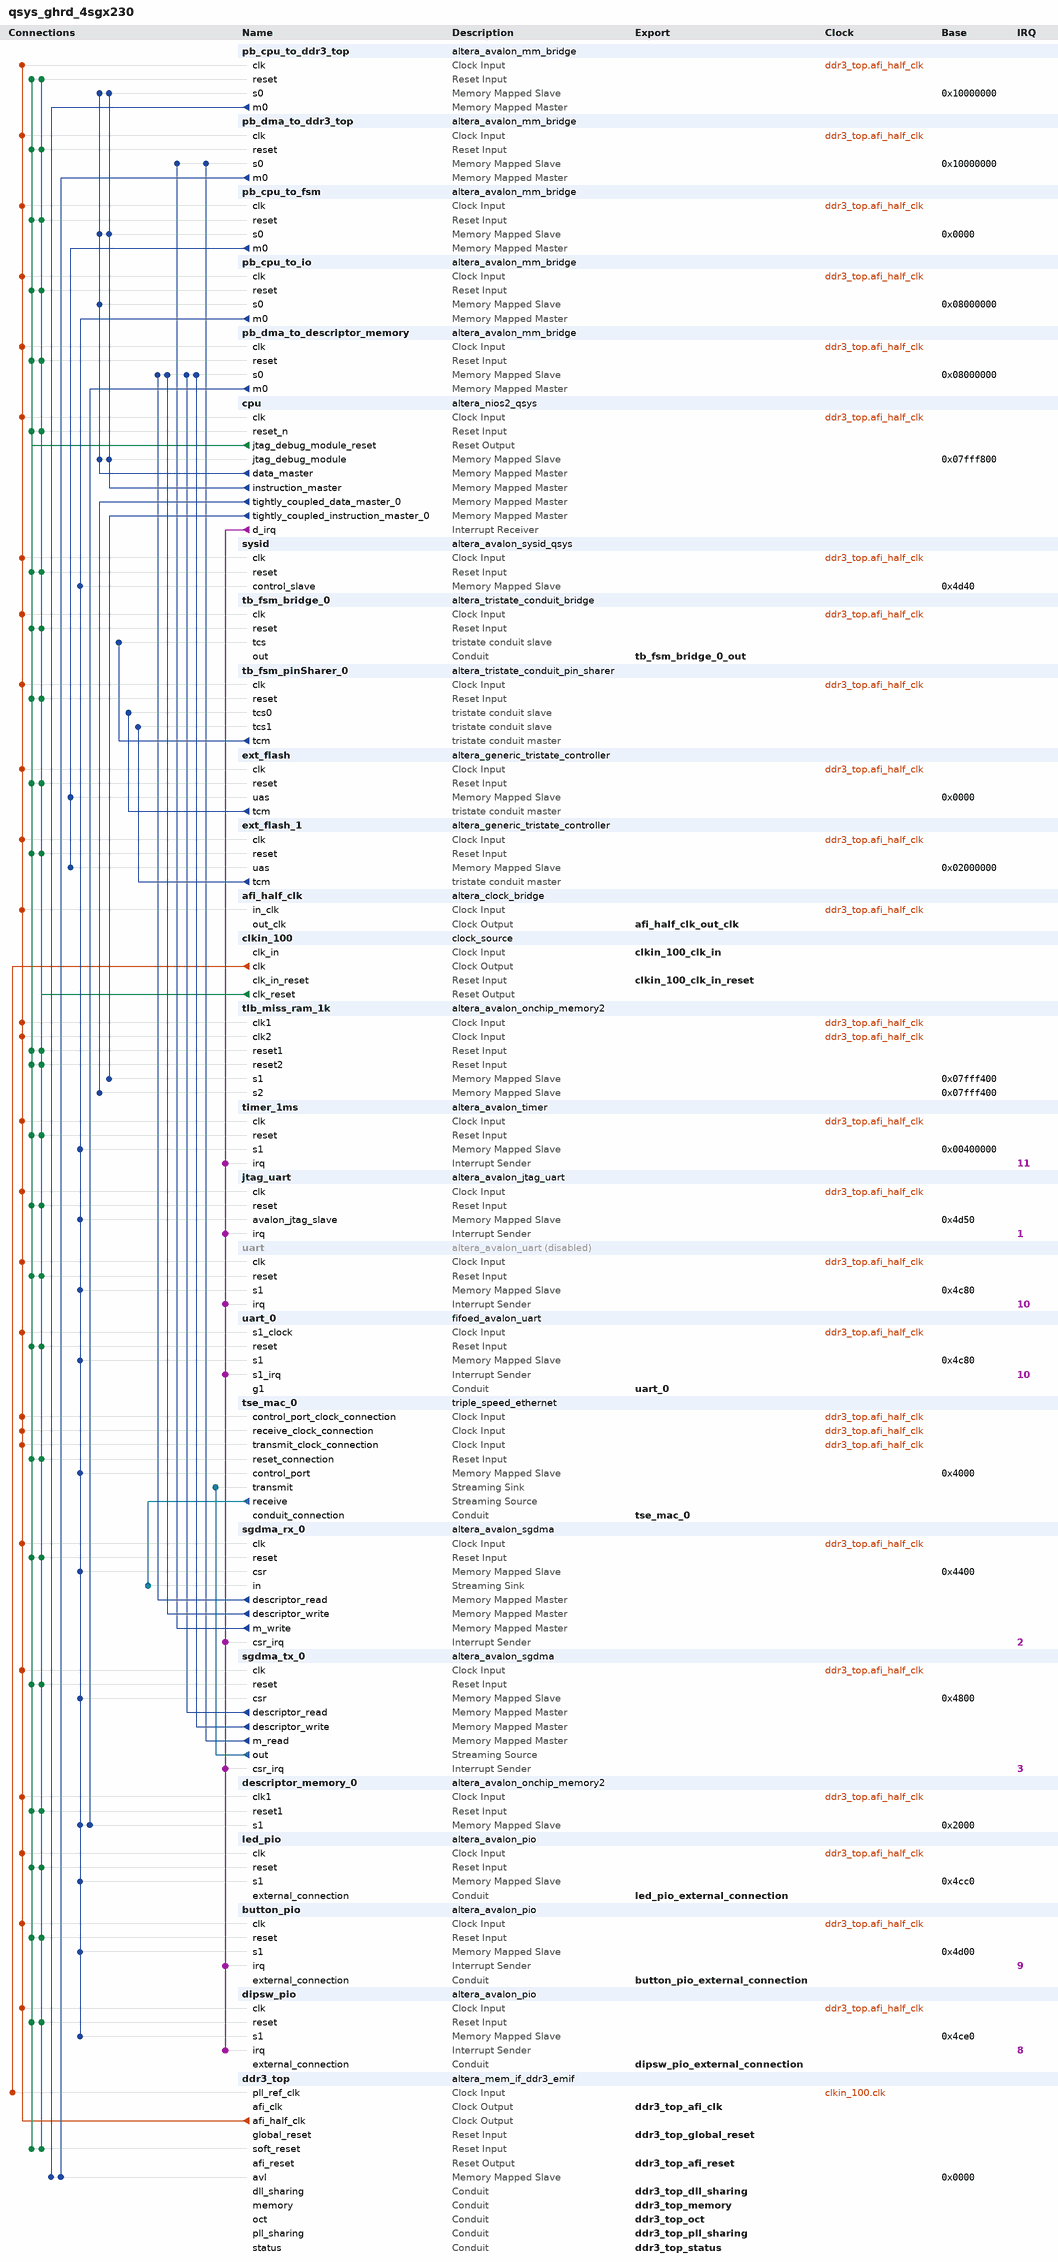
[diagram p0: system contents]
# Platform Designer (Qsys) system qsys_ghrd_4sgx230
# Parameters at their usual value, and those the tool derives, are not listed.
package require -exact qsys 11.1
create_system qsys_ghrd_4sgx230
set_project_property DEVICE_FAMILY STRATIXIV

add_instance pb_cpu_to_ddr3_top altera_avalon_mm_bridge 11.1
set_instance_parameter_value pb_cpu_to_ddr3_top DATA_WIDTH 32
set_instance_parameter_value pb_cpu_to_ddr3_top ADDRESS_WIDTH 27
set_instance_parameter_value pb_cpu_to_ddr3_top ADDRESS_UNITS SYMBOLS
set_instance_parameter_value pb_cpu_to_ddr3_top MAX_PENDING_RESPONSES 34

add_instance pb_dma_to_ddr3_top altera_avalon_mm_bridge 11.1
set_instance_parameter_value pb_dma_to_ddr3_top DATA_WIDTH 32
set_instance_parameter_value pb_dma_to_ddr3_top ADDRESS_WIDTH 27
set_instance_parameter_value pb_dma_to_ddr3_top ADDRESS_UNITS SYMBOLS
set_instance_parameter_value pb_dma_to_ddr3_top MAX_PENDING_RESPONSES 34

add_instance pb_cpu_to_fsm altera_avalon_mm_bridge 11.1
set_instance_parameter_value pb_cpu_to_fsm DATA_WIDTH 32
set_instance_parameter_value pb_cpu_to_fsm ADDRESS_WIDTH 26
set_instance_parameter_value pb_cpu_to_fsm ADDRESS_UNITS SYMBOLS
set_instance_parameter_value pb_cpu_to_fsm MAX_PENDING_RESPONSES 4

add_instance pb_cpu_to_io altera_avalon_mm_bridge 11.1
set_instance_parameter_value pb_cpu_to_io DATA_WIDTH 32
set_instance_parameter_value pb_cpu_to_io ADDRESS_WIDTH 23
set_instance_parameter_value pb_cpu_to_io ADDRESS_UNITS SYMBOLS
set_instance_parameter_value pb_cpu_to_io MAX_PENDING_RESPONSES 3

add_instance pb_dma_to_descriptor_memory altera_avalon_mm_bridge 11.1
set_instance_parameter_value pb_dma_to_descriptor_memory DATA_WIDTH 32
set_instance_parameter_value pb_dma_to_descriptor_memory ADDRESS_WIDTH 14
set_instance_parameter_value pb_dma_to_descriptor_memory ADDRESS_UNITS SYMBOLS
set_instance_parameter_value pb_dma_to_descriptor_memory MAX_PENDING_RESPONSES 2
set_instance_parameter_value pb_dma_to_descriptor_memory PIPELINE_RESPONSE 0

add_instance cpu altera_nios2_qsys 11.1
set_instance_parameter_value cpu muldiv_divider true
set_instance_parameter_value cpu mmu_enabled true
set_instance_parameter_value cpu manuallyAssignCpuID false
set_instance_parameter_value cpu resetOffset 8388608
set_instance_parameter_value cpu resetSlave ext_flash_1.uas
set_instance_parameter_value cpu mmu_TLBMissExcSlave tlb_miss_ram_1k.s1
set_instance_parameter_value cpu exceptionSlave ddr3_top.avl
set_instance_parameter_value cpu breakSlave cpu.jtag_debug_module
set_instance_parameter_value cpu muldiv_multiplierType DSPBlock
set_instance_parameter_value cpu impl Fast
set_instance_parameter_value cpu icache_size 32768
set_instance_parameter_value cpu icache_numTCIM 1
set_instance_parameter_value cpu dcache_size 32768
set_instance_parameter_value cpu dcache_numTCDM 1

add_instance sysid altera_avalon_sysid_qsys 11.1
set_instance_parameter_value sysid id 0

add_instance tb_fsm_bridge_0 altera_tristate_conduit_bridge 11.1

add_instance tb_fsm_pinSharer_0 altera_tristate_conduit_pin_sharer 11.1
set_instance_parameter_value tb_fsm_pinSharer_0 NUM_INTERFACES 2
set_instance_parameter_value tb_fsm_pinSharer_0 MODULE_ORIGIN_LIST ext_flash_1.tcm,ext_flash_1.tcm,ext_flash_1.tcm,ext_flash_1.tcm,ext_flash_1.tcm,ext_flash.tcm,ext_flash.tcm,ext_flash.tcm,ext_flash.tcm,ext_flash.tcm
set_instance_parameter_value tb_fsm_pinSharer_0 SIGNAL_ORIGIN_LIST address,read_n,write_n,data,chipselect_n,address,read_n,write_n,data,chipselect_n
set_instance_parameter_value tb_fsm_pinSharer_0 SHARED_SIGNAL_LIST tb_fsm_address,tb_fsm_readn,tb_fsm_writen,tb_fsm_data,select_n_to_the_ext_flash_1,tb_fsm_address,tb_fsm_readn,tb_fsm_writen,tb_fsm_data,select_n_to_the_ext_flash

add_instance ext_flash altera_generic_tristate_controller 11.1
set_instance_parameter_value ext_flash TCM_ADDRESS_W 25
set_instance_parameter_value ext_flash TCM_DATA_W 16
set_instance_parameter_value ext_flash TCM_BYTEENABLE_W 2
set_instance_parameter_value ext_flash TCM_READ_WAIT 100
set_instance_parameter_value ext_flash TCM_WRITE_WAIT 100
set_instance_parameter_value ext_flash TCM_SETUP_WAIT 25
set_instance_parameter_value ext_flash TCM_DATA_HOLD 20
set_instance_parameter_value ext_flash TCM_MAX_PENDING_READ_TRANSACTIONS 3
set_instance_parameter_value ext_flash TCM_TURNAROUND_TIME 2
set_instance_parameter_value ext_flash TCM_TIMING_UNITS 0
set_instance_parameter_value ext_flash TCM_READLATENCY 2
set_instance_parameter_value ext_flash TCM_SYMBOLS_PER_WORD 2
set_instance_parameter_value ext_flash USE_READ 1
set_instance_parameter_value ext_flash USE_BEGINTRANSFER 0
set_instance_parameter_value ext_flash USE_BYTEENABLE 0
set_instance_parameter_value ext_flash USE_OUTPUTENABLE 0
set_instance_parameter_value ext_flash ACTIVE_LOW_READ 1
set_instance_parameter_value ext_flash ACTIVE_LOW_BYTEENABLE 0
set_instance_parameter_value ext_flash ACTIVE_LOW_OUTPUTENABLE 0
set_instance_parameter_value ext_flash ACTIVE_LOW_BEGINTRANSFER 0
set_instance_parameter_value ext_flash CHIPSELECT_THROUGH_READLATENCY 0
set_instance_parameter_value ext_flash MODULE_ASSIGNMENT_KEYS embeddedsw.configuration.hwClassnameDriverSupportList,embeddedsw.configuration.hwClassnameDriverSupportDefault,embeddedsw.CMacro.SETUP_VALUE,embeddedsw.CMacro.WAIT_VALUE,embeddedsw.CMacro.HOLD_VALUE,embeddedsw.CMacro.TIMING_UNITS,embeddedsw.CMacro.SIZE,embeddedsw.memoryInfo.MEM_INIT_DATA_WIDTH,embeddedsw.memoryInfo.HAS_BYTE_LANE,embeddedsw.memoryInfo.IS_FLASH,embeddedsw.memoryInfo.GENERATE_DAT_SYM,embeddedsw.memoryInfo.GENERATE_FLASH,embeddedsw.memoryInfo.DAT_SYM_INSTALL_DIR,embeddedsw.memoryInfo.FLASH_INSTALL_DIR
set_instance_parameter_value ext_flash MODULE_ASSIGNMENT_VALUES {altera_avalon_lan91c111:altera_avalon_cfi_flash,altera_avalon_cfi_flash,25,100,20,"ns",33554432u,16,1,1,1,1,SIM_DIR,APP_DIR}
set_instance_parameter_value ext_flash INTERFACE_ASSIGNMENT_KEYS embeddedsw.configuration.isFlash,embeddedsw.configuration.isMemoryDevice,embeddedsw.configuration.isNonVolatileStorage
set_instance_parameter_value ext_flash INTERFACE_ASSIGNMENT_VALUES 1,1,1

add_instance ext_flash_1 altera_generic_tristate_controller 11.1
set_instance_parameter_value ext_flash_1 TCM_ADDRESS_W 25
set_instance_parameter_value ext_flash_1 TCM_DATA_W 16
set_instance_parameter_value ext_flash_1 TCM_BYTEENABLE_W 2
set_instance_parameter_value ext_flash_1 TCM_READ_WAIT 100
set_instance_parameter_value ext_flash_1 TCM_WRITE_WAIT 100
set_instance_parameter_value ext_flash_1 TCM_SETUP_WAIT 25
set_instance_parameter_value ext_flash_1 TCM_DATA_HOLD 20
set_instance_parameter_value ext_flash_1 TCM_MAX_PENDING_READ_TRANSACTIONS 3
set_instance_parameter_value ext_flash_1 TCM_TURNAROUND_TIME 2
set_instance_parameter_value ext_flash_1 TCM_TIMING_UNITS 0
set_instance_parameter_value ext_flash_1 TCM_READLATENCY 2
set_instance_parameter_value ext_flash_1 TCM_SYMBOLS_PER_WORD 2
set_instance_parameter_value ext_flash_1 USE_READ 1
set_instance_parameter_value ext_flash_1 USE_BEGINTRANSFER 0
set_instance_parameter_value ext_flash_1 USE_BYTEENABLE 0
set_instance_parameter_value ext_flash_1 USE_OUTPUTENABLE 0
set_instance_parameter_value ext_flash_1 ACTIVE_LOW_READ 1
set_instance_parameter_value ext_flash_1 ACTIVE_LOW_BYTEENABLE 0
set_instance_parameter_value ext_flash_1 ACTIVE_LOW_OUTPUTENABLE 0
set_instance_parameter_value ext_flash_1 ACTIVE_LOW_BEGINTRANSFER 0
set_instance_parameter_value ext_flash_1 CHIPSELECT_THROUGH_READLATENCY 0
set_instance_parameter_value ext_flash_1 MODULE_ASSIGNMENT_KEYS embeddedsw.configuration.hwClassnameDriverSupportList,embeddedsw.configuration.hwClassnameDriverSupportDefault,embeddedsw.CMacro.SETUP_VALUE,embeddedsw.CMacro.WAIT_VALUE,embeddedsw.CMacro.HOLD_VALUE,embeddedsw.CMacro.TIMING_UNITS,embeddedsw.CMacro.SIZE,embeddedsw.memoryInfo.MEM_INIT_DATA_WIDTH,embeddedsw.memoryInfo.HAS_BYTE_LANE,embeddedsw.memoryInfo.IS_FLASH,embeddedsw.memoryInfo.GENERATE_DAT_SYM,embeddedsw.memoryInfo.GENERATE_FLASH,embeddedsw.memoryInfo.DAT_SYM_INSTALL_DIR,embeddedsw.memoryInfo.FLASH_INSTALL_DIR
set_instance_parameter_value ext_flash_1 MODULE_ASSIGNMENT_VALUES {altera_avalon_lan91c111:altera_avalon_cfi_flash,altera_avalon_cfi_flash,25,100,20,"ns",33554432u,16,1,1,1,1,SIM_DIR,APP_DIR}
set_instance_parameter_value ext_flash_1 INTERFACE_ASSIGNMENT_KEYS embeddedsw.configuration.isFlash,embeddedsw.configuration.isMemoryDevice,embeddedsw.configuration.isNonVolatileStorage
set_instance_parameter_value ext_flash_1 INTERFACE_ASSIGNMENT_VALUES 1,1,1

add_instance afi_half_clk altera_clock_bridge 11.1
set_instance_parameter_value afi_half_clk DERIVED_CLOCK_RATE 75000000
set_instance_parameter_value afi_half_clk EXPLICIT_CLOCK_RATE 0

add_instance clkin_100 clock_source 11.1
set_instance_parameter_value clkin_100 clockFrequency 100000000

add_instance tlb_miss_ram_1k altera_avalon_onchip_memory2 11.1
set_instance_parameter_value tlb_miss_ram_1k dataWidth 32
set_instance_parameter_value tlb_miss_ram_1k dualPort true
set_instance_parameter_value tlb_miss_ram_1k initMemContent true
set_instance_parameter_value tlb_miss_ram_1k initializationFileName tlb_miss_ram_1k
set_instance_parameter_value tlb_miss_ram_1k memorySize 1024

add_instance timer_1ms altera_avalon_timer 11.1
set_instance_parameter_value timer_1ms period 1
set_instance_parameter_value timer_1ms periodUnits MSEC
set_instance_parameter_value timer_1ms timerPreset FULL_FEATURED

add_instance jtag_uart altera_avalon_jtag_uart 11.1
set_instance_parameter_value jtag_uart simInteractiveOptions INTERACTIVE_ASCII_OUTPUT

add_instance uart altera_avalon_uart 11.1
set_instance_property uart ENABLED false
set_instance_parameter_value uart baud 115200
set_instance_parameter_value uart dataBits 8
set_instance_parameter_value uart fixedBaud false
set_instance_parameter_value uart parity NONE
set_instance_parameter_value uart stopBits 1

add_instance uart_0 fifoed_avalon_uart 11.1
set_instance_parameter_value uart_0 clock_freq 75000000
set_instance_parameter_value uart_0 baud 115200
set_instance_parameter_value uart_0 data_bits 8
set_instance_parameter_value uart_0 fixed_baud true
set_instance_parameter_value uart_0 parity N
set_instance_parameter_value uart_0 stop_bits 1
set_instance_parameter_value uart_0 use_cts_rts false
set_instance_parameter_value uart_0 use_eop_register false
set_instance_parameter_value uart_0 sim_true_baud 0
set_instance_parameter_value uart_0 sim_char_stream DEADBEEF
set_instance_parameter_value uart_0 use_tx_fifo true
set_instance_parameter_value uart_0 fifo_size_tx 128
set_instance_parameter_value uart_0 tx_fifo_LE false
set_instance_parameter_value uart_0 tx_IRQ_Threshold 1
set_instance_parameter_value uart_0 use_rx_fifo true
set_instance_parameter_value uart_0 fifo_size_rx 128
set_instance_parameter_value uart_0 rx_fifo_LE false
set_instance_parameter_value uart_0 rx_IRQ_Threshold 1
set_instance_parameter_value uart_0 fifo_export_used false
set_instance_parameter_value uart_0 Has_IRQ true
set_instance_parameter_value uart_0 hw_cts false
set_instance_parameter_value uart_0 trans_pin false
set_instance_parameter_value uart_0 console_port true
set_instance_parameter_value uart_0 use_timout false
set_instance_parameter_value uart_0 timeout_value 4
set_instance_parameter_value uart_0 use_gap_detection false
set_instance_parameter_value uart_0 gap_value 4
set_instance_parameter_value uart_0 use_timestamp false
set_instance_parameter_value uart_0 use_ext_timestamp false
set_instance_parameter_value uart_0 timestamp_width 8
set_instance_parameter_value uart_0 add_error_bits false
set_instance_parameter_value uart_0 driver_pass_error_bits false

add_instance tse_mac_0 triple_speed_ethernet 11.1
set_instance_parameter_value tse_mac_0 atlanticSinkClockRate 0
set_instance_parameter_value tse_mac_0 atlanticSinkClockSource unassigned
set_instance_parameter_value tse_mac_0 atlanticSourceClockRate 0
set_instance_parameter_value tse_mac_0 atlanticSourceClockSource unassigned
set_instance_parameter_value tse_mac_0 avalonSlaveClockRate 0
set_instance_parameter_value tse_mac_0 avalonSlaveClockSource unassigned
set_instance_parameter_value tse_mac_0 avalonStNeighbours {unassigned=unassigned}
set_instance_parameter_value tse_mac_0 channel_count 1
set_instance_parameter_value tse_mac_0 core_variation MAC_PCS
set_instance_parameter_value tse_mac_0 core_version 2817
set_instance_parameter_value tse_mac_0 crc32check16bit 0
set_instance_parameter_value tse_mac_0 crc32dwidth 8
set_instance_parameter_value tse_mac_0 crc32gendelay 6
set_instance_parameter_value tse_mac_0 crc32s1l2_extern false
set_instance_parameter_value tse_mac_0 cust_version 0
set_instance_parameter_value tse_mac_0 dataBitsPerSymbol 8
set_instance_parameter_value tse_mac_0 dev_version 2817
set_instance_parameter_value tse_mac_0 eg_addr 11
set_instance_parameter_value tse_mac_0 ena_hash false
set_instance_parameter_value tse_mac_0 enable_alt_reconfig false
set_instance_parameter_value tse_mac_0 enable_clk_sharing false
set_instance_parameter_value tse_mac_0 enable_ena 32
set_instance_parameter_value tse_mac_0 enable_fifoless false
set_instance_parameter_value tse_mac_0 enable_gmii_loopback false
set_instance_parameter_value tse_mac_0 enable_hd_logic false
set_instance_parameter_value tse_mac_0 enable_mac_flow_ctrl false
set_instance_parameter_value tse_mac_0 enable_mac_txaddr_set true
set_instance_parameter_value tse_mac_0 enable_mac_vlan false
set_instance_parameter_value tse_mac_0 enable_maclite false
set_instance_parameter_value tse_mac_0 enable_magic_detect true
set_instance_parameter_value tse_mac_0 enable_multi_channel false
set_instance_parameter_value tse_mac_0 enable_pkt_class true
set_instance_parameter_value tse_mac_0 enable_pma false
set_instance_parameter_value tse_mac_0 enable_reg_sharing false
set_instance_parameter_value tse_mac_0 enable_sgmii true
set_instance_parameter_value tse_mac_0 enable_shift16 true
set_instance_parameter_value tse_mac_0 enable_sup_addr false
set_instance_parameter_value tse_mac_0 enable_use_internal_fifo true
set_instance_parameter_value tse_mac_0 export_calblkclk false
set_instance_parameter_value tse_mac_0 export_pwrdn false
set_instance_parameter_value tse_mac_0 ext_stat_cnt_ena false
set_instance_parameter_value tse_mac_0 gigeAdvanceMode true
set_instance_parameter_value tse_mac_0 ifGMII MII_GMII
set_instance_parameter_value tse_mac_0 ifPCSuseEmbeddedSerdes true
set_instance_parameter_value tse_mac_0 ing_addr 11
set_instance_parameter_value tse_mac_0 insert_ta true
set_instance_parameter_value tse_mac_0 maclite_gige false
set_instance_parameter_value tse_mac_0 max_channels 1
set_instance_parameter_value tse_mac_0 mdio_clk_div 40
set_instance_parameter_value tse_mac_0 phy_identifier 0
set_instance_parameter_value tse_mac_0 ramType AUTO
set_instance_parameter_value tse_mac_0 reset_level 1
set_instance_parameter_value tse_mac_0 starting_channel_number 0
set_instance_parameter_value tse_mac_0 stat_cnt_ena true
set_instance_parameter_value tse_mac_0 timingAdapterName timingAdapter
set_instance_parameter_value tse_mac_0 toolContext SOPC_BUILDER
set_instance_parameter_value tse_mac_0 transceiver_type LVDS_IO
set_instance_parameter_value tse_mac_0 uiHostClockFrequency 0
set_instance_parameter_value tse_mac_0 uiMDIOFreq {0.0 MHz}
set_instance_parameter_value tse_mac_0 useLvds true
set_instance_parameter_value tse_mac_0 useMAC true
set_instance_parameter_value tse_mac_0 useMDIO true
set_instance_parameter_value tse_mac_0 usePCS true
set_instance_parameter_value tse_mac_0 use_sync_reset true

add_instance sgdma_rx_0 altera_avalon_sgdma 11.1
set_instance_parameter_value sgdma_rx_0 enableBurstTransfers false
set_instance_parameter_value sgdma_rx_0 enableUnalignedTransfers true
set_instance_parameter_value sgdma_rx_0 readBlockDataWidth 32
set_instance_parameter_value sgdma_rx_0 sinkErrorWidth 6
set_instance_parameter_value sgdma_rx_0 sourceErrorWidth 0
set_instance_parameter_value sgdma_rx_0 transferMode STREAM_TO_MEMORY
set_instance_parameter_value sgdma_rx_0 writeBurstcountWidth 4

add_instance sgdma_tx_0 altera_avalon_sgdma 11.1
set_instance_parameter_value sgdma_tx_0 enableBurstTransfers false
set_instance_parameter_value sgdma_tx_0 enableUnalignedTransfers true
set_instance_parameter_value sgdma_tx_0 readBlockDataWidth 32
set_instance_parameter_value sgdma_tx_0 sinkErrorWidth 0
set_instance_parameter_value sgdma_tx_0 sourceErrorWidth 1
set_instance_parameter_value sgdma_tx_0 transferMode MEMORY_TO_STREAM
set_instance_parameter_value sgdma_tx_0 writeBurstcountWidth 4

add_instance descriptor_memory_0 altera_avalon_onchip_memory2 11.1
set_instance_parameter_value descriptor_memory_0 dataWidth 32
set_instance_parameter_value descriptor_memory_0 dualPort false
set_instance_parameter_value descriptor_memory_0 initMemContent true
set_instance_parameter_value descriptor_memory_0 initializationFileName descriptor_memory_0
set_instance_parameter_value descriptor_memory_0 memorySize 8192

add_instance led_pio altera_avalon_pio 11.1
set_instance_parameter_value led_pio direction Output
set_instance_parameter_value led_pio width 16

add_instance button_pio altera_avalon_pio 11.1
set_instance_parameter_value button_pio captureEdge true
set_instance_parameter_value button_pio direction Input
set_instance_parameter_value button_pio edgeType ANY
set_instance_parameter_value button_pio generateIRQ true
set_instance_parameter_value button_pio irqType EDGE
set_instance_parameter_value button_pio simDoTestBenchWiring true
set_instance_parameter_value button_pio simDrivenValue 7
set_instance_parameter_value button_pio width 3

add_instance dipsw_pio altera_avalon_pio 11.1
set_instance_parameter_value dipsw_pio bitClearingEdgeCapReg true
set_instance_parameter_value dipsw_pio captureEdge true
set_instance_parameter_value dipsw_pio direction Input
set_instance_parameter_value dipsw_pio edgeType ANY
set_instance_parameter_value dipsw_pio generateIRQ true
set_instance_parameter_value dipsw_pio irqType EDGE
set_instance_parameter_value dipsw_pio simDoTestBenchWiring true
set_instance_parameter_value dipsw_pio width 8

add_instance ddr3_top altera_mem_if_ddr3_emif 11.1
set_instance_parameter_value ddr3_top MEM_VENDOR Micron
set_instance_parameter_value ddr3_top MEM_FORMAT DISCRETE
set_instance_parameter_value ddr3_top MEM_CLK_FREQ_MAX 666.667
set_instance_parameter_value ddr3_top MEM_ROW_ADDR_WIDTH 13
set_instance_parameter_value ddr3_top MEM_COL_ADDR_WIDTH 10
set_instance_parameter_value ddr3_top MEM_DQ_WIDTH 16
set_instance_parameter_value ddr3_top MEM_BANKADDR_WIDTH 3
set_instance_parameter_value ddr3_top MEM_RTT_NOM RZQ/4
set_instance_parameter_value ddr3_top MEM_WTCL 6
set_instance_parameter_value ddr3_top MEM_TCL 8
set_instance_parameter_value ddr3_top TIMING_TIS 190
set_instance_parameter_value ddr3_top TIMING_TIH 140
set_instance_parameter_value ddr3_top TIMING_TDS 30
set_instance_parameter_value ddr3_top TIMING_TDH 65
set_instance_parameter_value ddr3_top TIMING_TDQSQ 125
set_instance_parameter_value ddr3_top TIMING_TDQSCK 255
set_instance_parameter_value ddr3_top TIMING_TDQSS 0.25
set_instance_parameter_value ddr3_top TIMING_TQSH 0.4
set_instance_parameter_value ddr3_top TIMING_TDSH 0.2
set_instance_parameter_value ddr3_top TIMING_TDSS 0.2
set_instance_parameter_value ddr3_top MEM_TRAS_NS 36.0
set_instance_parameter_value ddr3_top MEM_TRCD_NS 13.5
set_instance_parameter_value ddr3_top MEM_TRP_NS 13.5
set_instance_parameter_value ddr3_top MEM_TRFC_NS 110.0
set_instance_parameter_value ddr3_top MEM_TWTR 4
set_instance_parameter_value ddr3_top MEM_TFAW_NS 30.0
set_instance_parameter_value ddr3_top MEM_TRRD_NS 6.0
set_instance_parameter_value ddr3_top MEM_TRTP_NS 7.5
set_instance_parameter_value ddr3_top POWER_OF_TWO_BUS true
set_instance_parameter_value ddr3_top AVL_MAX_SIZE 16
set_instance_parameter_value ddr3_top CFG_REORDER_DATA false
set_instance_parameter_value ddr3_top PRIORITY_PORT 0,0,0,0,0,0
set_instance_parameter_value ddr3_top CPORT_TYPE_PORT Bidirectional,Bidirectional,Bidirectional,Bidirectional,Bidirectional,Bidirectional
set_instance_parameter_value ddr3_top REF_CLK_FREQ 100.0
set_instance_parameter_value ddr3_top HHP_REMAP_ADDR true
set_instance_parameter_value ddr3_top USE_SEQUENCER_APB_BRIDGE false
set_instance_parameter_value ddr3_top DEFAULT_FAST_SIM_MODEL true
set_instance_parameter_value ddr3_top PLL_SHARING_MODE Master
set_instance_parameter_value ddr3_top DLL_SHARING_MODE Master
set_instance_parameter_value ddr3_top PLL_LOCATION Top_Bottom
set_instance_parameter_value ddr3_top CALIBRATION_MODE Full
set_instance_parameter_value ddr3_top USER_DEBUG_LEVEL 1
set_instance_parameter_value ddr3_top TIMING_BOARD_DERATE_METHOD SLEW_RATE
set_instance_parameter_value ddr3_top TIMING_BOARD_MAX_CK_DELAY 0.6
set_instance_parameter_value ddr3_top TIMING_BOARD_MAX_DQS_DELAY 0.6
set_instance_parameter_value ddr3_top TIMING_BOARD_SKEW_CKDQS_DIMM_MIN -0.079
set_instance_parameter_value ddr3_top TIMING_BOARD_SKEW_CKDQS_DIMM_MAX -0.021
set_instance_parameter_value ddr3_top TIMING_BOARD_SKEW_WITHIN_DQS 0.017
set_instance_parameter_value ddr3_top TIMING_BOARD_SKEW_BETWEEN_DQS 0.058
set_instance_parameter_value ddr3_top TIMING_BOARD_DQ_TO_DQS_SKEW -0.0090
set_instance_parameter_value ddr3_top TIMING_BOARD_AC_SKEW 0.084
set_instance_parameter_value ddr3_top TIMING_BOARD_AC_TO_CK_SKEW -0.025
set_instance_parameter_value ddr3_top RATE Half
set_instance_parameter_value ddr3_top MEM_CLK_FREQ 300.0
set_instance_parameter_value ddr3_top DQS_TRK_ENABLED false
set_instance_parameter_value ddr3_top SPEED_GRADE 2
set_instance_parameter_value ddr3_top HARD_EMIF false
set_instance_parameter_value ddr3_top ENABLE_ABS_RAM_MEM_INIT true

# connections
add_connection clkin_100.clk ddr3_top.pll_ref_clk clock
add_connection ddr3_top.afi_half_clk afi_half_clk.in_clk clock
add_connection ddr3_top.afi_half_clk button_pio.clk clock
add_connection ddr3_top.afi_half_clk cpu.clk clock
add_connection ddr3_top.afi_half_clk descriptor_memory_0.clk1 clock
add_connection ddr3_top.afi_half_clk dipsw_pio.clk clock
add_connection ddr3_top.afi_half_clk ext_flash.clk clock
add_connection ddr3_top.afi_half_clk ext_flash_1.clk clock
add_connection ddr3_top.afi_half_clk jtag_uart.clk clock
add_connection ddr3_top.afi_half_clk led_pio.clk clock
add_connection ddr3_top.afi_half_clk pb_cpu_to_ddr3_top.clk clock
add_connection ddr3_top.afi_half_clk pb_cpu_to_fsm.clk clock
add_connection ddr3_top.afi_half_clk pb_cpu_to_io.clk clock
add_connection ddr3_top.afi_half_clk pb_dma_to_ddr3_top.clk clock
add_connection ddr3_top.afi_half_clk pb_dma_to_descriptor_memory.clk clock
add_connection ddr3_top.afi_half_clk sgdma_rx_0.clk clock
add_connection ddr3_top.afi_half_clk sgdma_tx_0.clk clock
add_connection ddr3_top.afi_half_clk sysid.clk clock
add_connection ddr3_top.afi_half_clk tb_fsm_bridge_0.clk clock
add_connection ddr3_top.afi_half_clk tb_fsm_pinSharer_0.clk clock
add_connection ddr3_top.afi_half_clk timer_1ms.clk clock
add_connection ddr3_top.afi_half_clk tlb_miss_ram_1k.clk1 clock
add_connection ddr3_top.afi_half_clk tlb_miss_ram_1k.clk2 clock
add_connection ddr3_top.afi_half_clk tse_mac_0.control_port_clock_connection clock
add_connection ddr3_top.afi_half_clk tse_mac_0.receive_clock_connection clock
add_connection ddr3_top.afi_half_clk tse_mac_0.transmit_clock_connection clock
add_connection ddr3_top.afi_half_clk uart.clk clock
add_connection ddr3_top.afi_half_clk uart_0.s1_clock clock
add_connection clkin_100.clk_reset button_pio.reset reset
add_connection clkin_100.clk_reset cpu.reset_n reset
add_connection clkin_100.clk_reset ddr3_top.soft_reset reset
add_connection clkin_100.clk_reset descriptor_memory_0.reset1 reset
add_connection clkin_100.clk_reset dipsw_pio.reset reset
add_connection clkin_100.clk_reset ext_flash.reset reset
add_connection clkin_100.clk_reset ext_flash_1.reset reset
add_connection clkin_100.clk_reset jtag_uart.reset reset
add_connection clkin_100.clk_reset led_pio.reset reset
add_connection clkin_100.clk_reset pb_cpu_to_ddr3_top.reset reset
add_connection clkin_100.clk_reset pb_cpu_to_fsm.reset reset
add_connection clkin_100.clk_reset pb_cpu_to_io.reset reset
add_connection clkin_100.clk_reset pb_dma_to_ddr3_top.reset reset
add_connection clkin_100.clk_reset pb_dma_to_descriptor_memory.reset reset
add_connection clkin_100.clk_reset sgdma_rx_0.reset reset
add_connection clkin_100.clk_reset sgdma_tx_0.reset reset
add_connection clkin_100.clk_reset sysid.reset reset
add_connection clkin_100.clk_reset tb_fsm_bridge_0.reset reset
add_connection clkin_100.clk_reset tb_fsm_pinSharer_0.reset reset
add_connection clkin_100.clk_reset timer_1ms.reset reset
add_connection clkin_100.clk_reset tlb_miss_ram_1k.reset1 reset
add_connection clkin_100.clk_reset tlb_miss_ram_1k.reset2 reset
add_connection clkin_100.clk_reset tse_mac_0.reset_connection reset
add_connection clkin_100.clk_reset uart.reset reset
add_connection clkin_100.clk_reset uart_0.reset reset
add_connection cpu.jtag_debug_module_reset button_pio.reset reset
add_connection cpu.jtag_debug_module_reset cpu.reset_n reset
add_connection cpu.jtag_debug_module_reset ddr3_top.soft_reset reset
add_connection cpu.jtag_debug_module_reset descriptor_memory_0.reset1 reset
add_connection cpu.jtag_debug_module_reset dipsw_pio.reset reset
add_connection cpu.jtag_debug_module_reset ext_flash.reset reset
add_connection cpu.jtag_debug_module_reset ext_flash_1.reset reset
add_connection cpu.jtag_debug_module_reset jtag_uart.reset reset
add_connection cpu.jtag_debug_module_reset led_pio.reset reset
add_connection cpu.jtag_debug_module_reset pb_cpu_to_ddr3_top.reset reset
add_connection cpu.jtag_debug_module_reset pb_cpu_to_fsm.reset reset
add_connection cpu.jtag_debug_module_reset pb_cpu_to_io.reset reset
add_connection cpu.jtag_debug_module_reset pb_dma_to_ddr3_top.reset reset
add_connection cpu.jtag_debug_module_reset pb_dma_to_descriptor_memory.reset reset
add_connection cpu.jtag_debug_module_reset sgdma_rx_0.reset reset
add_connection cpu.jtag_debug_module_reset sgdma_tx_0.reset reset
add_connection cpu.jtag_debug_module_reset sysid.reset reset
add_connection cpu.jtag_debug_module_reset tb_fsm_bridge_0.reset reset
add_connection cpu.jtag_debug_module_reset tb_fsm_pinSharer_0.reset reset
add_connection cpu.jtag_debug_module_reset timer_1ms.reset reset
add_connection cpu.jtag_debug_module_reset tlb_miss_ram_1k.reset1 reset
add_connection cpu.jtag_debug_module_reset tlb_miss_ram_1k.reset2 reset
add_connection cpu.jtag_debug_module_reset tse_mac_0.reset_connection reset
add_connection cpu.jtag_debug_module_reset uart.reset reset
add_connection cpu.jtag_debug_module_reset uart_0.reset reset
add_connection cpu.data_master cpu.jtag_debug_module avalon
set_connection_parameter_value cpu.data_master/cpu.jtag_debug_module baseAddress 0x07fff800
add_connection cpu.data_master pb_cpu_to_ddr3_top.s0 avalon
set_connection_parameter_value cpu.data_master/pb_cpu_to_ddr3_top.s0 arbitrationPriority 8
set_connection_parameter_value cpu.data_master/pb_cpu_to_ddr3_top.s0 baseAddress 0x10000000
add_connection cpu.data_master pb_cpu_to_fsm.s0 avalon
set_connection_parameter_value cpu.data_master/pb_cpu_to_fsm.s0 arbitrationPriority 8
set_connection_parameter_value cpu.data_master/pb_cpu_to_fsm.s0 baseAddress 0x0000
add_connection cpu.data_master pb_cpu_to_io.s0 avalon
set_connection_parameter_value cpu.data_master/pb_cpu_to_io.s0 baseAddress 0x08000000
add_connection cpu.instruction_master cpu.jtag_debug_module avalon
set_connection_parameter_value cpu.instruction_master/cpu.jtag_debug_module baseAddress 0x07fff800
add_connection cpu.instruction_master pb_cpu_to_ddr3_top.s0 avalon
set_connection_parameter_value cpu.instruction_master/pb_cpu_to_ddr3_top.s0 arbitrationPriority 8
set_connection_parameter_value cpu.instruction_master/pb_cpu_to_ddr3_top.s0 baseAddress 0x10000000
add_connection cpu.instruction_master pb_cpu_to_fsm.s0 avalon
set_connection_parameter_value cpu.instruction_master/pb_cpu_to_fsm.s0 arbitrationPriority 8
set_connection_parameter_value cpu.instruction_master/pb_cpu_to_fsm.s0 baseAddress 0x0000
add_connection cpu.tightly_coupled_data_master_0 tlb_miss_ram_1k.s2 avalon
set_connection_parameter_value cpu.tightly_coupled_data_master_0/tlb_miss_ram_1k.s2 baseAddress 0x07fff400
add_connection cpu.tightly_coupled_instruction_master_0 tlb_miss_ram_1k.s1 avalon
set_connection_parameter_value cpu.tightly_coupled_instruction_master_0/tlb_miss_ram_1k.s1 baseAddress 0x07fff400
add_connection pb_cpu_to_ddr3_top.m0 ddr3_top.avl avalon
set_connection_parameter_value pb_cpu_to_ddr3_top.m0/ddr3_top.avl baseAddress 0x0000
add_connection pb_cpu_to_fsm.m0 ext_flash.uas avalon
set_connection_parameter_value pb_cpu_to_fsm.m0/ext_flash.uas baseAddress 0x0000
add_connection pb_cpu_to_fsm.m0 ext_flash_1.uas avalon
set_connection_parameter_value pb_cpu_to_fsm.m0/ext_flash_1.uas baseAddress 0x02000000
add_connection pb_cpu_to_io.m0 button_pio.s1 avalon
set_connection_parameter_value pb_cpu_to_io.m0/button_pio.s1 baseAddress 0x4d00
add_connection pb_cpu_to_io.m0 descriptor_memory_0.s1 avalon
set_connection_parameter_value pb_cpu_to_io.m0/descriptor_memory_0.s1 baseAddress 0x2000
add_connection pb_cpu_to_io.m0 dipsw_pio.s1 avalon
set_connection_parameter_value pb_cpu_to_io.m0/dipsw_pio.s1 baseAddress 0x4ce0
add_connection pb_cpu_to_io.m0 jtag_uart.avalon_jtag_slave avalon
set_connection_parameter_value pb_cpu_to_io.m0/jtag_uart.avalon_jtag_slave baseAddress 0x4d50
add_connection pb_cpu_to_io.m0 led_pio.s1 avalon
set_connection_parameter_value pb_cpu_to_io.m0/led_pio.s1 baseAddress 0x4cc0
add_connection pb_cpu_to_io.m0 sgdma_rx_0.csr avalon
set_connection_parameter_value pb_cpu_to_io.m0/sgdma_rx_0.csr baseAddress 0x4400
add_connection pb_cpu_to_io.m0 sgdma_tx_0.csr avalon
set_connection_parameter_value pb_cpu_to_io.m0/sgdma_tx_0.csr baseAddress 0x4800
add_connection pb_cpu_to_io.m0 sysid.control_slave avalon
set_connection_parameter_value pb_cpu_to_io.m0/sysid.control_slave baseAddress 0x4d40
add_connection pb_cpu_to_io.m0 timer_1ms.s1 avalon
set_connection_parameter_value pb_cpu_to_io.m0/timer_1ms.s1 baseAddress 0x00400000
add_connection pb_cpu_to_io.m0 tse_mac_0.control_port avalon
set_connection_parameter_value pb_cpu_to_io.m0/tse_mac_0.control_port baseAddress 0x4000
add_connection pb_cpu_to_io.m0 uart.s1 avalon
set_connection_parameter_value pb_cpu_to_io.m0/uart.s1 baseAddress 0x4c80
add_connection pb_cpu_to_io.m0 uart_0.s1 avalon
set_connection_parameter_value pb_cpu_to_io.m0/uart_0.s1 baseAddress 0x4c80
add_connection pb_dma_to_ddr3_top.m0 ddr3_top.avl avalon
set_connection_parameter_value pb_dma_to_ddr3_top.m0/ddr3_top.avl baseAddress 0x0000
add_connection pb_dma_to_descriptor_memory.m0 descriptor_memory_0.s1 avalon
set_connection_parameter_value pb_dma_to_descriptor_memory.m0/descriptor_memory_0.s1 arbitrationPriority 8
set_connection_parameter_value pb_dma_to_descriptor_memory.m0/descriptor_memory_0.s1 baseAddress 0x2000
add_connection sgdma_rx_0.descriptor_read pb_dma_to_descriptor_memory.s0 avalon
set_connection_parameter_value sgdma_rx_0.descriptor_read/pb_dma_to_descriptor_memory.s0 arbitrationPriority 8
set_connection_parameter_value sgdma_rx_0.descriptor_read/pb_dma_to_descriptor_memory.s0 baseAddress 0x08000000
add_connection sgdma_rx_0.descriptor_write pb_dma_to_descriptor_memory.s0 avalon
set_connection_parameter_value sgdma_rx_0.descriptor_write/pb_dma_to_descriptor_memory.s0 arbitrationPriority 8
set_connection_parameter_value sgdma_rx_0.descriptor_write/pb_dma_to_descriptor_memory.s0 baseAddress 0x08000000
add_connection sgdma_rx_0.m_write pb_dma_to_ddr3_top.s0 avalon
set_connection_parameter_value sgdma_rx_0.m_write/pb_dma_to_ddr3_top.s0 arbitrationPriority 8
set_connection_parameter_value sgdma_rx_0.m_write/pb_dma_to_ddr3_top.s0 baseAddress 0x10000000
add_connection sgdma_tx_0.descriptor_read pb_dma_to_descriptor_memory.s0 avalon
set_connection_parameter_value sgdma_tx_0.descriptor_read/pb_dma_to_descriptor_memory.s0 arbitrationPriority 8
set_connection_parameter_value sgdma_tx_0.descriptor_read/pb_dma_to_descriptor_memory.s0 baseAddress 0x08000000
add_connection sgdma_tx_0.descriptor_write pb_dma_to_descriptor_memory.s0 avalon
set_connection_parameter_value sgdma_tx_0.descriptor_write/pb_dma_to_descriptor_memory.s0 arbitrationPriority 8
set_connection_parameter_value sgdma_tx_0.descriptor_write/pb_dma_to_descriptor_memory.s0 baseAddress 0x08000000
add_connection sgdma_tx_0.m_read pb_dma_to_ddr3_top.s0 avalon
set_connection_parameter_value sgdma_tx_0.m_read/pb_dma_to_ddr3_top.s0 arbitrationPriority 8
set_connection_parameter_value sgdma_tx_0.m_read/pb_dma_to_ddr3_top.s0 baseAddress 0x10000000
add_connection sgdma_tx_0.out tse_mac_0.transmit avalon_streaming
add_connection tse_mac_0.receive sgdma_rx_0.in avalon_streaming
add_connection cpu.d_irq button_pio.irq interrupt
set_connection_parameter_value cpu.d_irq/button_pio.irq irqNumber 9
add_connection cpu.d_irq dipsw_pio.irq interrupt
set_connection_parameter_value cpu.d_irq/dipsw_pio.irq irqNumber 8
add_connection cpu.d_irq jtag_uart.irq interrupt
set_connection_parameter_value cpu.d_irq/jtag_uart.irq irqNumber 1
add_connection cpu.d_irq sgdma_rx_0.csr_irq interrupt
set_connection_parameter_value cpu.d_irq/sgdma_rx_0.csr_irq irqNumber 2
add_connection cpu.d_irq sgdma_tx_0.csr_irq interrupt
set_connection_parameter_value cpu.d_irq/sgdma_tx_0.csr_irq irqNumber 3
add_connection cpu.d_irq timer_1ms.irq interrupt
set_connection_parameter_value cpu.d_irq/timer_1ms.irq irqNumber 11
add_connection cpu.d_irq uart.irq interrupt
set_connection_parameter_value cpu.d_irq/uart.irq irqNumber 10
add_connection cpu.d_irq uart_0.s1_irq interrupt
set_connection_parameter_value cpu.d_irq/uart_0.s1_irq irqNumber 10
add_connection ext_flash.tcm tb_fsm_pinSharer_0.tcs0 tristate_conduit
add_connection ext_flash_1.tcm tb_fsm_pinSharer_0.tcs1 tristate_conduit
add_connection tb_fsm_pinSharer_0.tcm tb_fsm_bridge_0.tcs tristate_conduit

# exported interfaces
add_interface ddr3_top_dll_sharing conduit end
set_interface_property ddr3_top_dll_sharing EXPORT_OF ddr3_top.dll_sharing
add_interface afi_half_clk_out_clk clock source
set_interface_property afi_half_clk_out_clk EXPORT_OF afi_half_clk.out_clk
add_interface tb_fsm_bridge_0_out conduit end
set_interface_property tb_fsm_bridge_0_out EXPORT_OF tb_fsm_bridge_0.out
add_interface ddr3_top_afi_clk clock source
set_interface_property ddr3_top_afi_clk EXPORT_OF ddr3_top.afi_clk
add_interface dipsw_pio_external_connection conduit end
set_interface_property dipsw_pio_external_connection EXPORT_OF dipsw_pio.external_connection
add_interface clkin_100_clk_in_reset reset sink
set_interface_property clkin_100_clk_in_reset EXPORT_OF clkin_100.clk_in_reset
add_interface led_pio_external_connection conduit end
set_interface_property led_pio_external_connection EXPORT_OF led_pio.external_connection
add_interface ddr3_top_pll_sharing conduit end
set_interface_property ddr3_top_pll_sharing EXPORT_OF ddr3_top.pll_sharing
add_interface clkin_100_clk_in clock sink
set_interface_property clkin_100_clk_in EXPORT_OF clkin_100.clk_in
add_interface button_pio_external_connection conduit end
set_interface_property button_pio_external_connection EXPORT_OF button_pio.external_connection
add_interface ddr3_top_oct conduit end
set_interface_property ddr3_top_oct EXPORT_OF ddr3_top.oct
add_interface ddr3_top_status conduit end
set_interface_property ddr3_top_status EXPORT_OF ddr3_top.status
add_interface ddr3_top_memory conduit end
set_interface_property ddr3_top_memory EXPORT_OF ddr3_top.memory
add_interface ddr3_top_global_reset reset sink
set_interface_property ddr3_top_global_reset EXPORT_OF ddr3_top.global_reset
add_interface ddr3_top_afi_reset reset source
set_interface_property ddr3_top_afi_reset EXPORT_OF ddr3_top.afi_reset
add_interface uart_0 conduit end
set_interface_property uart_0 EXPORT_OF uart_0.g1
add_interface tse_mac_0 conduit end
set_interface_property tse_mac_0 EXPORT_OF tse_mac_0.conduit_connection

save_system qsys_ghrd_4sgx230.qsys
